# Altium project DDS_PCB.PrjPcb
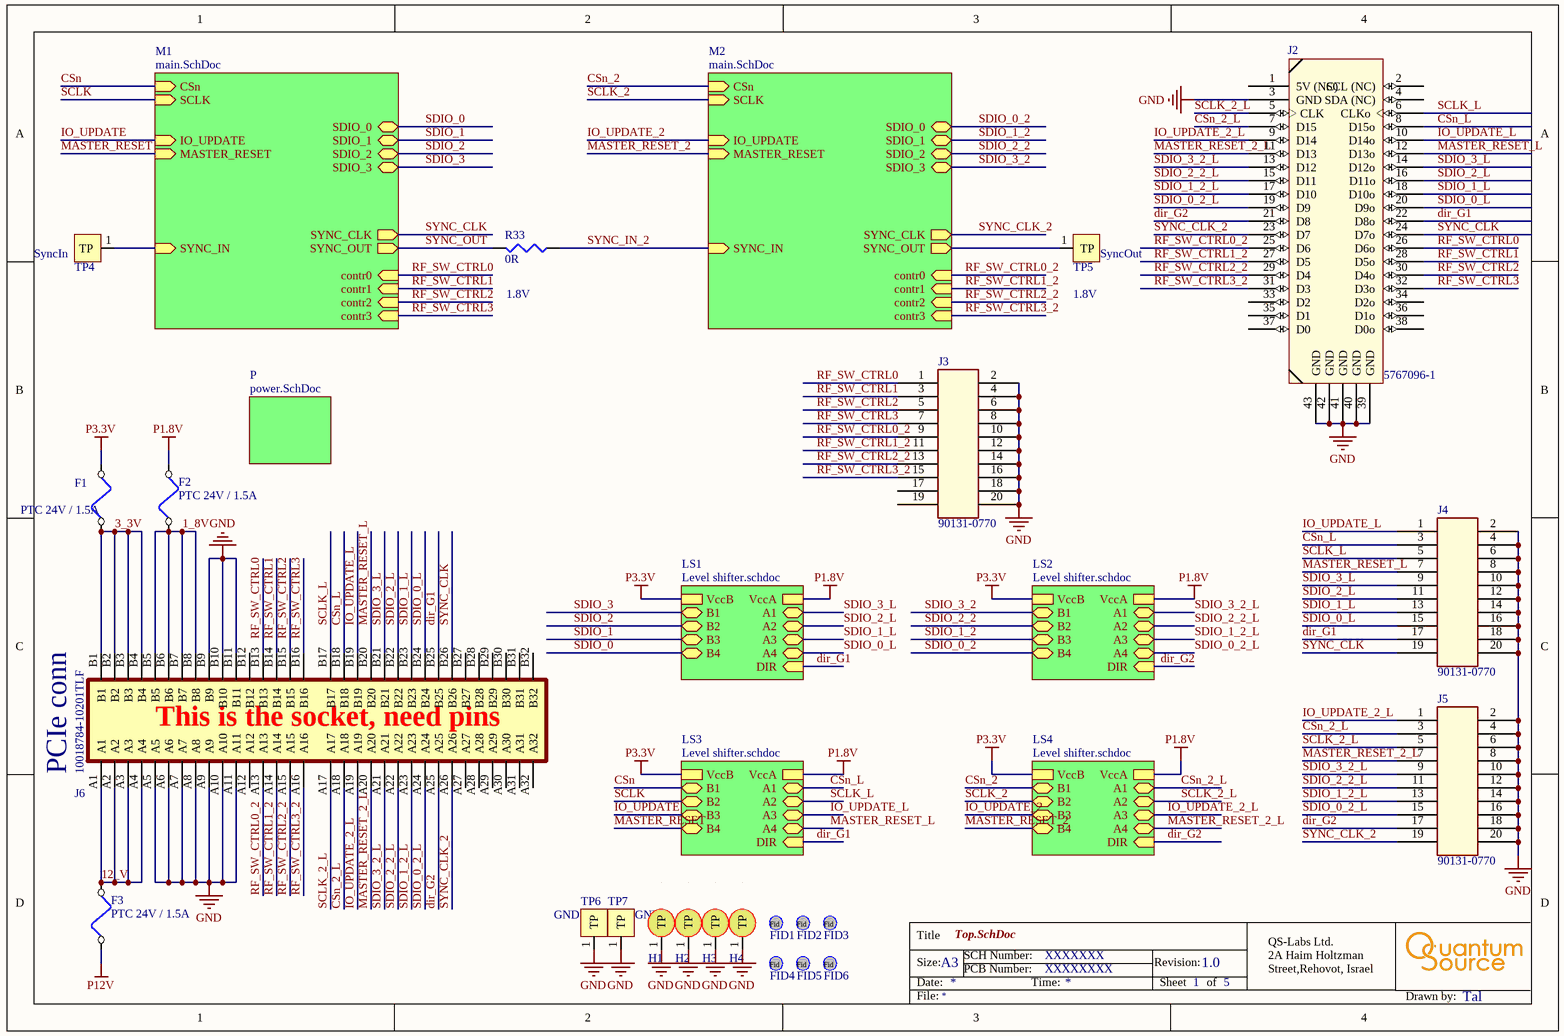
[diagram p0: Top.SchDoc]
Author: Tal; PCB Number: XXXXXXXX; Revision: 1.0; SCH Number: XXXXXXX
5 sheets, 448 parts. Net scope: hierarchical (ports join the sheet entries above them; power ports are global).
Board file: DDS_PCB.PcbDoc
Sheets:
  Top.SchDoc
    M1 = main.SchDoc
      A0 = analog_channel.SchDoc
      A1 = analog_channel.SchDoc
      A2 = analog_channel.SchDoc
      A3 = analog_channel.SchDoc
    P = power.SchDoc
    M2 = main.SchDoc
      A0 = analog_channel.SchDoc
      A1 = analog_channel.SchDoc
      A2 = analog_channel.SchDoc
      A3 = analog_channel.SchDoc
    LS2 = Level Shifter.SchDoc
    LS1 = Level Shifter.SchDoc
    LS3 = Level Shifter.SchDoc
    LS4 = Level Shifter.SchDoc

## Sheet Top.SchDoc
size A4; DocumentNumber: 3; SheetNumber: 1; SheetTotal: 5

### Parts
F1  PTC 24V / 1.5A  [1812_F]
F2  PTC 24V / 1.5A  [1812_F]
F3  PTC 24V / 1.5A  [1812_F]
FID1  Fiducial  [Fiducial]  (value not drawn)
FID2  Fiducial  [Fiducial]  (value not drawn)
FID3  Fiducial  [Fiducial]  (value not drawn)
FID4  Fiducial  [Fiducial]  (value not drawn)
FID5  Fiducial  [Fiducial]  (value not drawn)
FID6  Fiducial  [Fiducial]  (value not drawn)
H1  Hole 3mm  [hole 3mm]  (value not drawn)
H2  Hole 3mm  [hole 3mm]  (value not drawn)
H3  Hole 3mm  [hole 3mm]  (value not drawn)
H4  Hole 3mm  [hole 3mm]  (value not drawn)
J2  5767096-1  [MICTOR-38_PIN]
J3  90131-0770  [HEADER_10x2]
J4  90131-0770  [HEADER_10x2]
J5  90131-0770  [HEADER_10x2]
J6  10018784-10201TLF  [PCIE_8LANE_EDGE]
R33  0R  [R0402]
TP4  SyncIn  [TP_2x1.8]
TP5  SyncOut  [TP_2x1.8]
TP6  GND  [TP_2x1.8]
TP7  GND  [TP_2x1.8]

### Sub-sheets
LS1 = Level shifter.schdoc: A4 (bidir), B3 (bidir), A2 (bidir), B1 (bidir), B4 (bidir), A1 (bidir), B2 (bidir), A3 (bidir), VccA, VccB, DIR (in)
LS2 = Level shifter.schdoc: A4 (bidir), B3 (bidir), A2 (bidir), B1 (bidir), B4 (bidir), A1 (bidir), B2 (bidir), A3 (bidir), VccA, VccB, DIR (in)
LS3 = Level shifter.schdoc: A4 (bidir), B3 (bidir), A2 (bidir), B1 (bidir), B4 (bidir), A1 (bidir), B2 (bidir), A3 (bidir), VccA, VccB, DIR (in)
LS4 = Level shifter.schdoc: A4 (bidir), B3 (bidir), A2 (bidir), B1 (bidir), B4 (bidir), A1 (bidir), B2 (bidir), A3 (bidir), VccA, VccB, DIR (in)
M1 = main.SchDoc: SYNC_CLK (out), SYNC_OUT (out), SDIO_0 (bidir), SDIO_1 (bidir), SDIO_2 (bidir), SDIO_3 (bidir), CSn (in), IO_UPDATE (in), MASTER_RESET (in), SCLK (in), SYNC_IN (in), contr0 (in), contr1 (in), contr2 (in), contr3 (in)
M2 = main.SchDoc: SYNC_CLK (out), SYNC_OUT (out), SDIO_0 (bidir), SDIO_1 (bidir), SDIO_2 (bidir), SDIO_3 (bidir), CSn (in), IO_UPDATE (in), MASTER_RESET (in), SCLK (in), SYNC_IN (in), contr0 (in), contr1 (in), contr2 (in), contr3 (in)
P = power.SchDoc: no entries

### Nets
GND: H1.1(TP) H2.1(TP) H3.1(TP) H4.1(TP) J2.3(GND) J2.39(GND) J2.40(GND) J2.41(GND) J2.42(GND) J2.43(GND) J3.2 J3.4 J3.6 J3.8 J3.10 J3.12 J3.14 J3.16 J3.18 J3.20 J4.2 J4.4 J4.6 J4.8 J4.10 J4.12 J4.14 J4.16 J4.18 J4.20 J5.2 J5.4 J5.6 J5.8 J5.10 J5.12 J5.14 J5.16 J5.18 J5.20 J6.A5 J6.A6 J6.A7 J6.A8 J6.A9 J6.A10 J6.A11 J6.B9 J6.B10 J6.B11 TP6.1(TP) TP7.1(TP)
P1.8V: F2.2 ; sheet LS2/VccA, sheet LS1/VccA, sheet LS3/VccA, sheet LS4/VccA  [project net VccA]
P3.3V: F1.2 ; sheet LS2/VccB, sheet LS1/VccB, sheet LS3/VccB, sheet LS4/VccB  [project net VccB]
P12V: F3.1
1_8V: F2.1 J6.B5 J6.B6 J6.B7 J6.B8
3_3V: F1.1 J6.B1 J6.B2 J6.B3 J6.B4
12_V: F3.2 J6.A1 J6.A2 J6.A3 J6.A4
CSn: sheet M1/CSn, sheet LS3/B1
CSn_2: sheet M2/CSn, sheet LS4/B1
CSn_2_L: J2.7(D15) J5.3 J6.A18 ; sheet LS4/A1
CSn_L: J2.8(D15o) J4.3 J6.B18 ; sheet LS3/A1
dir_G1: J2.22(D8o) J4.17 J6.B25 ; sheet LS1/DIR, sheet LS3/DIR  [project net DIR]
dir_G2: J2.21(D8) J5.17 J6.A25 ; sheet LS2/DIR, sheet LS4/DIR  [project net DIR]
IO_UPDATE: sheet M1/IO_UPDATE, sheet LS3/B3
IO_UPDATE_2: sheet M2/IO_UPDATE, sheet LS4/B3
IO_UPDATE_2_L: J2.9(D14) J5.1 J6.A19 ; sheet LS4/A3
IO_UPDATE_L: J2.10(D14o) J4.1 J6.B19 ; sheet LS3/A3
MASTER_RESET: sheet M1/MASTER_RESET, sheet LS3/B4
MASTER_RESET_2: sheet M2/MASTER_RESET, sheet LS4/B4
MASTER_RESET_2_L: J2.11(D13) J5.7 J6.A20 ; sheet LS4/A4
MASTER_RESET_L: J2.12(D13o) J4.7 J6.B20 ; sheet LS3/A4
RF_SW_CTRL0: J2.26(D6o) J3.1 J6.B13 ; sheet M1/contr0  [project net contr0]
RF_SW_CTRL0_2: J2.25(D6) J3.9 J6.A13 ; sheet M2/contr0  [project net contr0]
RF_SW_CTRL1: J2.28(D5o) J3.3 J6.B14 ; sheet M1/contr1  [project net contr1]
RF_SW_CTRL1_2: J2.27(D5) J3.11 J6.A14 ; sheet M2/contr1  [project net contr1]
RF_SW_CTRL2: J2.30(D4o) J3.5 J6.B15 ; sheet M1/contr2  [project net contr2]
RF_SW_CTRL2_2: J2.29(D4) J3.13 J6.A15 ; sheet M2/contr2  [project net contr2]
RF_SW_CTRL3: J2.32(D3o) J3.7 J6.B16 ; sheet M1/contr3  [project net contr3]
RF_SW_CTRL3_2: J2.31(D3) J3.15 J6.A16 ; sheet M2/contr3  [project net contr3]
SCLK: sheet M1/SCLK, sheet LS3/B2
SCLK_2: sheet M2/SCLK, sheet LS4/B2
SCLK_2_L: J2.5(CLK) J5.5 J6.A17 ; sheet LS4/A2
SCLK_L: J2.6(CLKo) J4.5 J6.B17 ; sheet LS3/A2
SDIO_0: sheet M1/SDIO_0, sheet LS1/B4
SDIO_0_2: sheet M2/SDIO_0, sheet LS2/B4
SDIO_0_2_L: J2.19(D9) J5.15 J6.A24 ; sheet LS2/A4
SDIO_0_L: J2.20(D9o) J4.15 J6.B24 ; sheet LS1/A4
SDIO_1: sheet M1/SDIO_1, sheet LS1/B3
SDIO_1_2: sheet M2/SDIO_1, sheet LS2/B3
SDIO_1_2_L: J2.17(D10) J5.13 J6.A23 ; sheet LS2/A3
SDIO_1_L: J2.18(D10o) J4.13 J6.B23 ; sheet LS1/A3
SDIO_2: sheet M1/SDIO_2, sheet LS1/B2
SDIO_2_2: sheet M2/SDIO_2, sheet LS2/B2
SDIO_2_2_L: J2.15(D11) J5.11 J6.A22 ; sheet LS2/A2
SDIO_2_L: J2.16(D11o) J4.11 J6.B22 ; sheet LS1/A2
SDIO_3: sheet M1/SDIO_3, sheet LS1/B1
SDIO_3_2: sheet M2/SDIO_3, sheet LS2/B1
SDIO_3_2_L: J2.13(D12) J5.9 J6.A21 ; sheet LS2/A1
SDIO_3_L: J2.14(D12o) J4.9 J6.B21 ; sheet LS1/A1
SYNC_CLK: J2.24(D7o) J4.19 J6.B26 ; sheet M1/SYNC_CLK
SYNC_CLK_2: J2.23(D7) J5.19 J6.A26 ; sheet M2/SYNC_CLK
SYNC_IN: TP4.1(TP) ; sheet M1/SYNC_IN
SYNC_IN_2: R33.1 ; sheet M2/SYNC_IN
SYNC_OUT: TP5.1(TP) ; sheet M2/SYNC_OUT
SYNC_OUT: R33.2 ; sheet M1/SYNC_OUT  [a separate net that carries the same name]

Not connected (* = marked no-connect by the designer): J2 1(5V_(NC)) 2(SCL_(NC)) 4(SDA_(NC)) 33(D2) 34(D2o) 35(D1) 36(D1o) 37(D0) 38(D0o); J3 17 19; J6 A12 A27 A28 A29 A30 A31 A32 B12 B27 B28 B29 B30 B31 B32

### Notes on the sheet
- (near R33) 1.8V
- (near TP5) 1.8V
- (near J6) PCIe conn
- (near J6) This is the socket, need pins
- Title
- Size:
- Date:
- A3
- PCB Number:
- SCH Number:
- Time:
- Revision:
- Sheet
- of
- QS-Labs Ltd.
  2A Haim Holtzman Street,Rehovot, Israel
- File:
- Drawn by:
- (in symbol Fiducial) Fid

### Library data of the parts
F1-F3 = 1812L150/24MR: FUSE PTC 24V 1.5A POLYFUSE 1812; Manufacturer: Littelfuse Inc; LANDA P/N: EFS-000011; Package / Case: 1812 (4532 Metric), Concave; RoHS: RoHS Compliant; Manufacturer Part Number: 1812L150/24MR; ComponentLink1URL: http://www.littelfuse.com/data/en/Data_Sheets/Littelfuse_PTC_1812L.pdf; ComponentLink1Description: http://www.littelfuse.com/data/en/Data_Sheets/Littelfuse_PTC_1812L.pdf; Current - Hold (Ih) (Max): 1.5A
FID1-FID6 = Fiducial: Assembly: NA
J2 = 5767096-1: CONN MICTOR 38POS .025 VERT SMD; Manufacturer: TE Connectivity; LANDA P/N: ECN-000060; RoHS: RoHS Compliant; ComponentLink1URL: http://www.te.com/commerce/DocumentDelivery/DDEController?Action=srchrtrv&DocNm=5767096&DocType=Customer+Drawing&DocLang=English; ComponentLink1Description: http://www.te.com/commerce/DocumentDelivery/DDEController?Action=srchrtrv&DocNm=5767096&DocType=Customer+Drawing&DocLang=English; Manufacturer Part Number: 5767096-1
J3-J5 = 90131-0770: CONN HEADER 20 TH; Manufacturer: Molex Connector Corporation; LANDA P/N: ECN-000005; RoHS: RoHS Compliant; Mounting Type: Through Hole; Contact Type: Male Pin; ComponentLink1URL: http://www.molex.com/pdm_docs/sd/901310770_sd.pdf; ComponentLink1Description: http://www.molex.com/pdm_docs/sd/901310770_sd.pdf; Manufacturer Part Number: 90131-0770
J6 = 10018784-10201TLF: 64 Position Female Connector PCI Expressâ„¢ Gold 0.039 _1.00mm_ Black; MF: Amphenol ICC; Price: None; Value: *; MP: 10018784-10201TLF; Package: None; SnapEDA_Link: https://www.snapeda.com/parts/10018784-10201TLF/Amphenol%20FCI/view-part/2598016/?ref=snap; Availability: Unavailable
R33 = RES 100 OHM 1/10W 1% 0402 SMD: RES 0 OHM 1/10W 1% 0402 SMD; Manufacturer Part Number: ERJ-2RKF1000X; Manufacturer: Panasonic Electronic Components; LANDA P/N: ERS-000079; Assembly: N.C; Package / Case: 0402 (1005 Metric); RoHS: RoHS Compliant; ComponentLink1URL: http://industrial.panasonic.com/www-cgi/jvcr13pz.cgi?E+PZ+3+AOA0002+ERJ2RKF1000X+7+WW; ComponentLink1Description: http://industrial.panasonic.com/www-cgi/jvcr13pz.cgi?E+PZ+3+AOA0002+ERJ2RKF1000X+7+WW; Supplier Device Package: 0402
TP4-TP6 = TP mini_2: TP PC MINIATURE SMT; Manufacturer: Keystone Electronics; Manufacturer Part Number: 5015; Assembly: N.A; LANDA P/N: ECN-000032; RoHS: RoHS Compliant
TP7 = TP mini_1: TP PC MINIATURE SMT; Manufacturer: Keystone Electronics; Manufacturer Part Number: 5015; Assembly: N.A; LANDA P/N: ECN-000032; RoHS: RoHS Compliant

## Sheet main.SchDoc
size A4; DocumentNumber: 1; SheetNumber: 2; SheetTotal: 5; SPICEModelCacheQOCYWOGJ: <root> / <DocumentId>QOCYWOGJ</DocumentId> / </root>
Used 2 times, as channels M1, M2. Parts and nets are listed once, with the designators drawn on the sheet.
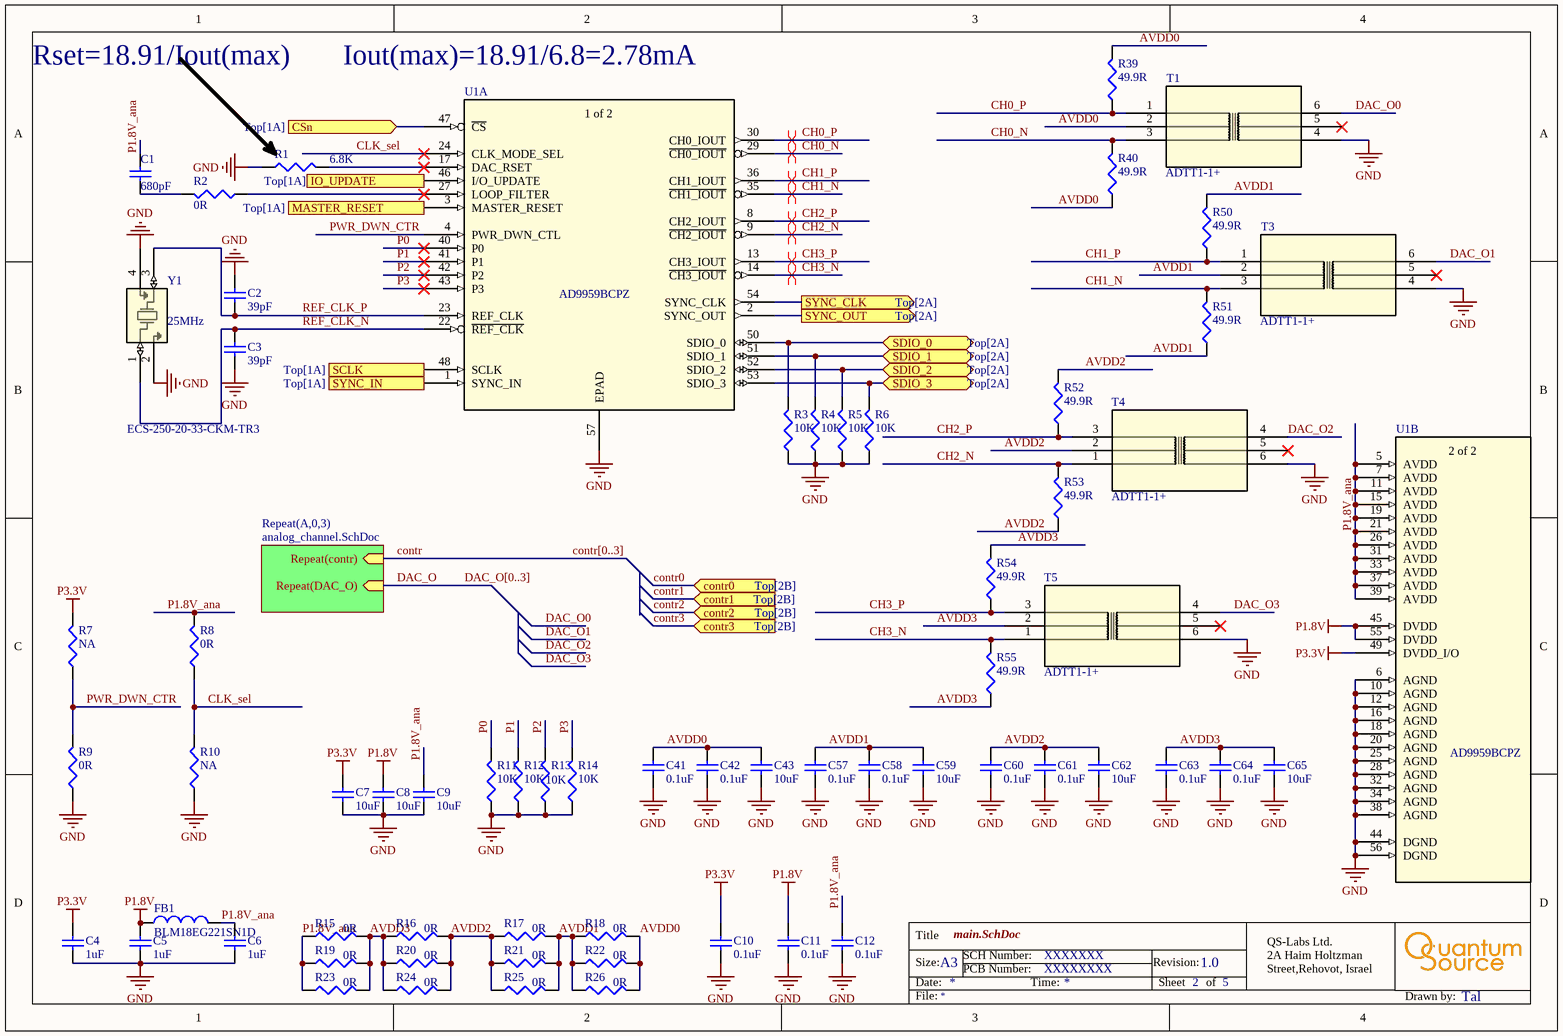
[diagram p1: main.SchDoc]

### Parts
C1  Capacitance: 680pF  [C0402]  (hidden comment: 680pF 50V)
C2  Capacitance: 39pF  [C0402]  (hidden comment: 39pF 50V)
C3  Capacitance: 39pF  [C0402]  (hidden comment: 39pF 50V)
C4  Capacitance: 1uF  [C0402]  (hidden comment: 1uF 25V)
C5  Capacitance: 1uF  [C0402]  (hidden comment: 1uF 25V)
C6  Capacitance: 1uF  [C0402]  (hidden comment: 1uF 25V)
C7  Capacitance: 10uF  [C0402]  (hidden comment: 10uF 10V)
C8  Capacitance: 10uF  [C0402]  (hidden comment: 10uF 10V)
C9  Capacitance: 10uF  [C0402]  (hidden comment: 10uF 10V)
C10  Capacitance: 0.1uF  [C0402]  (hidden comment: 0.1uF 50V)
C11  Capacitance: 0.1uF  [C0402]  (hidden comment: 0.1uF 50V)
C12  Capacitance: 0.1uF  [C0402]  (hidden comment: 0.1uF 50V)
C41  Capacitance: 0.1uF  [C0402]  (hidden comment: 0.1uF 50V)
C42  Capacitance: 0.1uF  [C0402]  (hidden comment: 0.1uF 50V)
C43  Capacitance: 10uF  [C0402]  (hidden comment: 10uF 10V)
C57  Capacitance: 0.1uF  [C0402]  (hidden comment: 0.1uF 50V)
C58  Capacitance: 0.1uF  [C0402]  (hidden comment: 0.1uF 50V)
C59  Capacitance: 10uF  [C0402]  (hidden comment: 10uF 10V)
C60  Capacitance: 0.1uF  [C0402]  (hidden comment: 0.1uF 50V)
C61  Capacitance: 0.1uF  [C0402]  (hidden comment: 0.1uF 50V)
C62  Capacitance: 10uF  [C0402]  (hidden comment: 10uF 10V)
C63  Capacitance: 0.1uF  [C0402]  (hidden comment: 0.1uF 50V)
C64  Capacitance: 0.1uF  [C0402]  (hidden comment: 0.1uF 50V)
C65  Capacitance: 10uF  [C0402]  (hidden comment: 10uF 10V)
FB1  BLM18EG221SN1D  [fb0603]
R1  6.8K  [R0402]
R2  0R  [R0402]
R3  10K  [R0402]
R4  10K  [R0402]
R5  10K  [R0402]
R6  10K  [R0402]
R7  NA  [R0402]
R8  0R  [R0402]
R9  0R  [R0402]
R10  NA  [R0402]
R11  10K  [R0402]
R12  10K  [R0402]
R13  10K  [R0402]
R14  10K  [R0402]
R15  0R  [R0805]
R16  0R  [R0805]
R17  0R  [R0805]
R18  0R  [R0805]
R19  0R  [R0805]
R20  0R  [R0805]
R21  0R  [R0805]
R22  0R  [R0805]
R23  0R  [R0805]
R24  0R  [R0805]
R25  0R  [R0805]
R26  0R  [R0805]
R39  49.9R  [R0402]
R40  49.9R  [R0402]
R50  49.9R  [R0402]
R51  49.9R  [R0402]
R52  49.9R  [R0402]
R53  49.9R  [R0402]
R54  49.9R  [R0402]
R55  49.9R  [R0402]
T1  ADTT1-1+  [CD542_MNC]
T3  ADTT1-1+  [CD542_MNC]
T4  ADTT1-1+  [CD542_MNC]
T5  ADTT1-1+  [CD542_MNC]
U1  AD9959BCPZ  [CP_56_1_ADI]  (parts A,B of 2)
Y1  ECS-250-20-33-CKM-TR3  [SMD4_ECX-32_3p2x2p5_ECS]

### Sub-sheets
Repeat(A,0,3) = analog_channel.SchDoc: Repeat(contr) (in), Repeat(DAC_O) (in)

### Ports
contr0 (in, see Top[2B]), contr1 (in, see Top[2B]), contr2 (in, see Top[2B]), contr3 (in, see Top[2B]), CSn (in, see Top[1A]), IO_UPDATE (in, see Top[1A]), MASTER_RESET (in, see Top[1A]), SCLK (in, see Top[1A]), SDIO_0 (bidir, see Top[2A]), SDIO_1 (bidir, see Top[2A]), SDIO_2 (bidir, see Top[2A]), SDIO_3 (bidir, see Top[2A]), SYNC_CLK (out, see Top[2A]), SYNC_IN (in, see Top[1A]), SYNC_OUT (out, see Top[2A])

### Nets
GND: C2.2 C3.1 C4.1 C5.1 C6.1 C7.1 C8.1 C9.1 C10.1 C11.1 C12.1 C41.1 C42.1 C43.1 C57.1 C58.1 C59.1 C60.1 C61.1 C62.1 C63.1 C64.1 C65.1 R1.1 R3.1 R4.1 R5.1 R6.1 R9.1 R10.1 R11.1 R12.1 R13.1 R14.1 T1.4 T3.4 T4.6 T5.6 U1.6(AGND) U1.10(AGND) U1.12(AGND) U1.16(AGND) U1.18(AGND) U1.20(AGND) U1.25(AGND) U1.28(AGND) U1.32(AGND) U1.34(AGND) U1.38(AGND) U1.44(DGND) U1.56(DGND) U1.57(EPAD) Y1.2 Y1.4
P1.8V: C5.2 C8.2 C11.2 FB1.1 U1.45(DVDD) U1.55(DVDD)
P3.3V: C4.2 C7.2 C10.2 R7.2 U1.49(DVDD_I/O)
AVDD0: C41.2 C42.2 C43.2 R18.2 R22.2 R26.2 R39.2 R40.1 T1.2
AVDD1: C57.2 C58.2 C59.2 R17.2 R18.1 R21.2 R22.1 R25.2 R26.1 R50.2 R51.1 T3.2
AVDD2: C60.2 C61.2 C62.2 R16.2 R17.1 R20.2 R21.1 R24.2 R25.1 R52.2 R53.1 T4.2
AVDD3: C63.2 C64.2 C65.2 R15.2 R16.1 R19.2 R20.1 R23.2 R24.1 R54.2 R55.1 T5.2
CH0_N: R40.2 T1.3 U1.29(~{CH0_IOUT})
CH0_P: R39.1 T1.1 U1.30(CH0_IOUT)
CH1_N: R51.2 T3.3 U1.35(~{CH1_IOUT})
CH1_P: R50.1 T3.1 U1.36(CH1_IOUT)
CH2_N: R53.2 T4.1 U1.9(~{CH2_IOUT})
CH2_P: R52.1 T4.3 U1.8(CH2_IOUT)
CH3_N: R55.2 T5.1 U1.14(~{CH3_IOUT})
CH3_P: R54.1 T5.3 U1.13(CH3_IOUT)
CLK_sel: R8.1 R10.2 U1.24(CLK_MODE_SEL)
contr: sheet Repeat(A,0,3)/Repeat(contr)
contr0: port contr0
contr1: port contr1
contr2: port contr2
contr3: port contr3
CSn: U1.47(~{CS}) ; port CSn
DAC_O: sheet Repeat(A,0,3)/Repeat(DAC_O)
DAC_O0: T1.6
DAC_O1: T3.6
DAC_O2: T4.4
DAC_O3: T5.4
IO_UPDATE: U1.46(I/O_UPDATE) ; port IO_UPDATE
MASTER_RESET: U1.3(MASTER_RESET) ; port MASTER_RESET
P0: R11.2 U1.40(P0)
P1: R12.2 U1.41(P1)
P1.8V_ana: C1.1 C6.2 C9.2 C12.2 FB1.2 R8.2 R15.1 R19.1 R23.1 U1.5(AVDD) U1.7(AVDD) U1.11(AVDD) U1.15(AVDD) U1.19(AVDD) U1.21(AVDD) U1.26(AVDD) U1.31(AVDD) U1.33(AVDD) U1.37(AVDD) U1.39(AVDD)
P2: R13.2 U1.42(P2)
P3: R14.2 U1.43(P3)
PWR_DWN_CTR: R7.1 R9.2 U1.4(PWR_DWN_CTL)
REF_CLK_N: C3.2 U1.22(~{REF_CLK}) Y1.1
REF_CLK_P: C2.1 U1.23(REF_CLK) Y1.3
SCLK: U1.48(SCLK) ; port SCLK
SDIO_0: R3.2 U1.50(SDIO_0) ; port SDIO_0
SDIO_1: R4.2 U1.51(SDIO_1) ; port SDIO_1
SDIO_2: R5.2 U1.52(SDIO_2) ; port SDIO_2
SDIO_3: R6.2 U1.53(SDIO_3) ; port SDIO_3
SYNC_CLK: U1.54(SYNC_CLK) ; port SYNC_CLK
SYNC_IN: U1.1(SYNC_IN) ; port SYNC_IN
SYNC_OUT: U1.2(SYNC_OUT) ; port SYNC_OUT
NetC1_2: C1.2 R2.2
NetR1_2: R1.2 U1.17(DAC_RSET)
NetR2_1: R2.1 U1.27(LOOP_FILTER)

Not connected (* = marked no-connect by the designer): T1 5*; T3 5*; T4 5*; T5 5*

### Channels
M1: designators end in _M1; ports contr0=contr0 contr1=contr1 contr2=contr2 contr3=contr3 CSn=CSn IO_UPDATE=IO_UPDATE MASTER_RESET=MASTER_RESET SCLK=SCLK SDIO_0=SDIO_0 SDIO_1=SDIO_1 SDIO_2=SDIO_2 SDIO_3=SDIO_3 SYNC_CLK=SYNC_CLK SYNC_IN=SYNC_IN SYNC_OUT=SYNC_OUT
M2: designators end in _M2; ports contr0=contr0 contr1=contr1 contr2=contr2 contr3=contr3 CSn=CSn_2 IO_UPDATE=IO_UPDATE_2 MASTER_RESET=MASTER_RESET_2 SCLK=SCLK_2 SDIO_0=SDIO_0_2 SDIO_1=SDIO_1_2 SDIO_2=SDIO_2_2 SDIO_3=SDIO_3_2 SYNC_CLK=SYNC_CLK_2 SYNC_IN=SYNC_IN_2 SYNC_OUT=SYNC_OUT

### Buses and harness runs
bus contr[0..3]
bus DAC_O[0..3]

### Layout directives
differential pair: CH0_N_M1, CH0_P_M1, CH1_N_M1, CH1_P_M1, CH2_N_M1, CH2_P_M1, CH3_N_M1, CH3_P_M1

### Notes on the sheet
- Rset=18.91/Iout(max)
- Iout(max)=18.91/6.8=2.78mA
- (near Y1) 25MHz
- Title
- Size:
- Date:
- A3
- PCB Number:
- SCH Number:
- Time:
- Revision:
- Sheet
- of
- QS-Labs Ltd.
  2A Haim Holtzman Street,Rehovot, Israel
- File:
- Drawn by:
- (in symbol AD9959BCPZ, part A) 1 of 2
- (in symbol AD9959BCPZ, part B) 2 of 2

### Library data of the parts
C1 = CAP CER 6.8pF 50V NP0 0402: CAP CER 680PF 50V NP0 0402; Manufacturer Part Number: C1005C0G1H6R8D; Manufacturer: TDK Corporation; LANDA P/N: ECP-000033; RoHS: RoHS Compliant; Package / Case: 0402 (1005 Metric); ComponentLink1URL: http://www.tdk.com/pdf/general_B11.pdf; ComponentLink1Description: http://www.tdk.com/pdf/general_B11.pdf; Voltage - Rated: 50V
C2 C3 = CAP CER 6.8pF 50V NP0 0402: CAP CER 39PF 50V NP0 0402; Manufacturer Part Number: C1005C0G1H6R8D; Manufacturer: TDK Corporation; LANDA P/N: ECP-000033; RoHS: RoHS Compliant; Package / Case: 0402 (1005 Metric); ComponentLink1URL: http://www.tdk.com/pdf/general_B11.pdf; ComponentLink1Description: http://www.tdk.com/pdf/general_B11.pdf; Voltage - Rated: 50V
C4-C6 = CAP CER 6.8pF 50V NP0 0402: CAP CER 1uF 25V X5R 0402; Manufacturer Part Number: C1005C0G1H6R8D; Manufacturer: TDK Corporation; LANDA P/N: ECP-000033; Voltage - Rated: 50V; RoHS: RoHS Compliant; Package / Case: 0402 (1005 Metric); ComponentLink1URL: http://www.tdk.com/pdf/general_B11.pdf; ComponentLink1Description: http://www.tdk.com/pdf/general_B11.pdf
C7-C9 C43 C59 C62 C65 = CAP CER 6.8pF 50V NP0 0402: CAP CER 10uF 10V X5R 0402; Manufacturer Part Number: C1005C0G1H6R8D; Manufacturer: TDK Corporation; LANDA P/N: ECP-000033; Voltage - Rated: 50V; RoHS: RoHS Compliant; Package / Case: 0402 (1005 Metric); ComponentLink1URL: http://www.tdk.com/pdf/general_B11.pdf; ComponentLink1Description: http://www.tdk.com/pdf/general_B11.pdf
C10-C12 C41 C42 C57 C58 C60 C61 C63 C64 = CAP CER 6.8pF 50V NP0 0402: CAP CER 0.1uF 50V NP0 0402; Manufacturer Part Number: C1005C0G1H6R8D; Manufacturer: TDK Corporation; LANDA P/N: ECP-000033; RoHS: RoHS Compliant; Package / Case: 0402 (1005 Metric); ComponentLink1URL: http://www.tdk.com/pdf/general_B11.pdf; ComponentLink1Description: http://www.tdk.com/pdf/general_B11.pdf; Voltage - Rated: 50V
FB1 = BK1608HS600-T: FERRITE BEAD 220_OHM@100MHz 0603 2A 50mohm_DC; Manufacturer: Taiyo Yuden; LANDA P/N: EIN-000010; RoHS: RoHS Compliant; Package / Case: 0603 (1608 Metric); ComponentLink1URL: http://www.yuden.co.jp/ut/product/category/emisuppression/BK1608HS600-T.pdf; ComponentLink1Description: http://www.yuden.co.jp/ut/product/category/emisuppression/BK1608HS600-T.pdf; Manufacturer Part Number: BLM18EG221SN1D
R1 = RES 3.09K OHM 1/16W 1% 0402: RES 6.8K OHM 1/16W 1% 0402; Manufacturer Part Number: RMCF0402FT3K09; Manufacturer: Stackpole Electronics Inc; Power (Watts): 0.063W, 1/16W; LANDA P/N: ERS-000063; Supplier Device Package: 0402; Package / Case: 0402 (1005 Metric); RoHS: RoHS Compliant; ComponentLink1URL: http://www.seielect.com/Catalog/SEI-RMCF_RMCP.pdf; ComponentLink1Description: http://www.seielect.com/Catalog/SEI-RMCF_RMCP.pdf
R2 R7-R10 = RES 100 OHM 1/10W 1% 0402 SMD: as R33 on sheet Top; Package / Case: 0402 (1005 Metric); RoHS: RoHS Compliant; ComponentLink1URL: http://industrial.panasonic.com/www-cgi/jvcr13pz.cgi?E+PZ+3+AOA0002+ERJ2RKF1000X+7+WW; ComponentLink1Description: http://industrial.panasonic.com/www-cgi/jvcr13pz.cgi?E+PZ+3+AOA0002+ERJ2RKF1000X+7+WW; Supplier Device Package: 0402
R3-R6 R11-R14 = RES 3.09K OHM 1/16W 1% 0402: RES 10K OHM 1/16W 1% 0402; Manufacturer Part Number: RMCF0402FT3K09; Manufacturer: Stackpole Electronics Inc; Power (Watts): 0.063W, 1/16W; LANDA P/N: ERS-000063; Supplier Device Package: 0402; Package / Case: 0402 (1005 Metric); RoHS: RoHS Compliant; ComponentLink1URL: http://www.seielect.com/Catalog/SEI-RMCF_RMCP.pdf; ComponentLink1Description: http://www.seielect.com/Catalog/SEI-RMCF_RMCP.pdf
R15-R26 = RES 200 OHM 1/8W 1% 0805 SMD: RES 0 OHM 1/8W 1% 0805 SMD; Manufacturer Part Number: RMCF0805FT200R; Manufacturer: Stackpole Electronics Inc; Power (Watts): 0.125W, 1/8W; LANDA P/N: ERS-000050; Package / Case: 0805 (2012 Metric); RoHS: RoHS Compliant; Supplier Device Package: 0805; ComponentLink1URL: http://www.seielect.com/Catalog/SEI-RMCF_RMCP.pdf; ComponentLink1Description: http://www.seielect.com/Catalog/SEI-RMCF_RMCP.pdf
R39 R40 R50-R55 = RES 100 OHM 1/10W 1% 0402 SMD: RES 49.9 OHM 1/10W 1% 0402 SMD; Manufacturer Part Number: ERJ-2RKF1000X; Manufacturer: Panasonic Electronic Components; LANDA P/N: ERS-000079; Assembly: N.C; Package / Case: 0402 (1005 Metric); RoHS: RoHS Compliant; ComponentLink1URL: http://industrial.panasonic.com/www-cgi/jvcr13pz.cgi?E+PZ+3+AOA0002+ERJ2RKF1000X+7+WW; ComponentLink1Description: http://industrial.panasonic.com/www-cgi/jvcr13pz.cgi?E+PZ+3+AOA0002+ERJ2RKF1000X+7+WW; Supplier Device Package: 0402
T1 T3-T5 = ADTT1-1+: No Description Available; Mfr_Name: Mini Circuits; Type: DEV; Copyright: Copyright (C) 2023 Ultra Librarian. All rights reserved.; Manufacturer_Part_Number: ADTT1-1+; RefDes: RefDes
U1 = AD9959BCPZ: No Description Available; Mfr_Name: Analog Devices Inc; Copyright: Copyright (C) 2023 Ultra Librarian. All rights reserved.; Manufacturer_Part_Number: AD9959BCPZ; RefDes: RefDes; Type: DEV
Y1 = ECS-250-20-33-CKM-TR3: No Description Available; Mfr_Name: ECS International; Type: DEV; Copyright: Copyright (C) 2023 Ultra Librarian. All rights reserved.; Manufacturer_Part_Number: ECS-250-20-33-CKM-TR3; RefDes: RefDes

## Sheet analog_channel.SchDoc
size A4; DocumentNumber: 5; SheetNumber: 3; SheetTotal: 5
Used 8 times, as channels M1/A0, M1/A1, M1/A2, M1/A3, M2/A0, M2/A1, M2/A2, M2/A3. Parts and nets are listed once, with the designators drawn on the sheet.
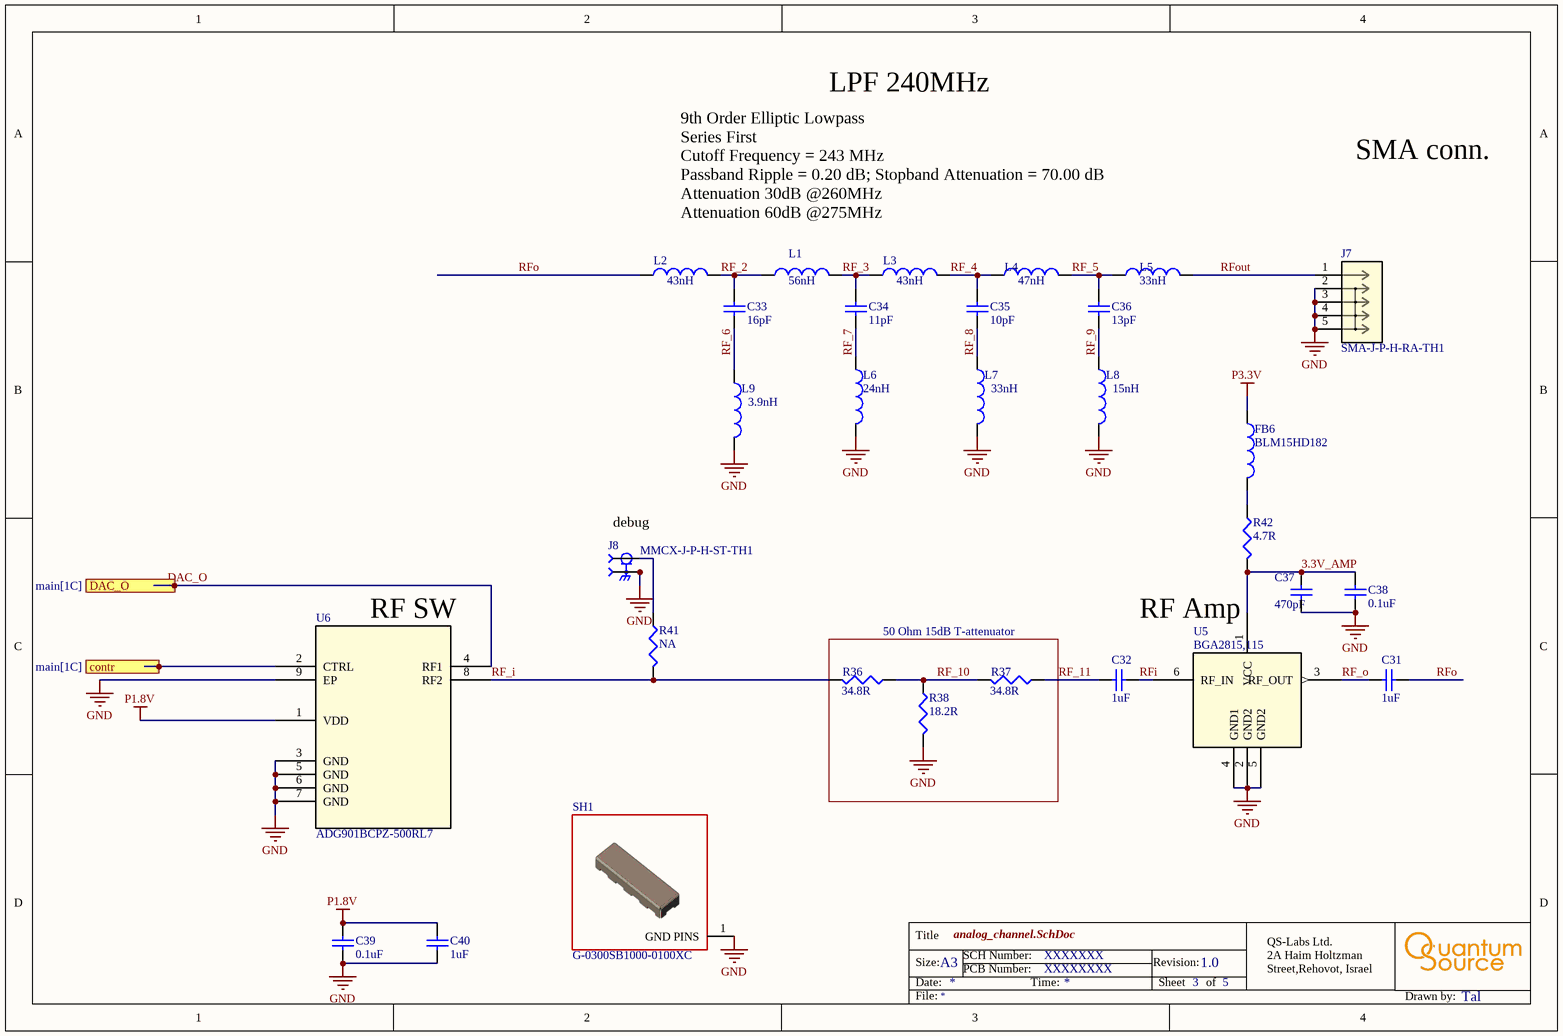
[diagram p2: analog_channel.SchDoc]

### Parts
C31  Capacitance: 1uF  [C0402]  (hidden comment: 1uF 25V)
C32  Capacitance: 1uF  [C0402]  (hidden comment: 1uF 25V)
C33  Capacitance: 16pF  [C0402]  (hidden comment: 16pF 50V)
C34  Capacitance: 11pF  [C0402]  (hidden comment: 11pF 50V)
C35  Capacitance: 10pF  [C0402]  (hidden comment: 10pF 50V)
C36  Capacitance: 13pF  [C0402]  (hidden comment: 13pF 50V)
C37  Capacitance: 470pF  [C0402]  (hidden comment: 470pF 25V)
C38  Capacitance: 0.1uF  [C0402]  (hidden comment: 0.1uF 50V)
C39  Capacitance: 0.1uF  [C0402]  (hidden comment: 0.1uF 50V)
C40  Capacitance: 1uF  [C0402]  (hidden comment: 1uF 25V)
FB6  BLM15HD182  [0402-A]
J7  SMA-J-P-H-RA-TH1  [CONN_SMA-J-P-H-RA-TH1_SAI]
J8  MMCX-J-P-H-ST-TH1  [SAMTEC_MMCX-J-P-H-ST-TH1]
L1  value 56nH  [0402-A]  (hidden comment: Inductor)
L2  value 43nH  [0402-A]  (hidden comment: Inductor)
L3  value 43nH  [0402-A]  (hidden comment: Inductor)
L4  value 47nH  [0402-A]  (hidden comment: Inductor)
L5  value 33nH  [0402-A]  (hidden comment: Inductor)
L6  value 24nH  [0402-A]  (hidden comment: Inductor)
L7  value 33nH  [0402-A]  (hidden comment: Inductor)
L8  value 15nH  [0402-A]  (hidden comment: Inductor)
L9  value 3.9nH  [0402-A]  (hidden comment: Inductor)
R36  34.8R  [r0402]
R37  34.8R  [r0402]
R38  18.2R  [r0402]
R41  NA  [r0402]
R42  4.7R  [r0402]
SH1  G-0300SB1000-0100XC  [RF_Sh]
U5  BGA2815,115  [SOT_2815,115_NXP]
U6  ADG901BCPZ-500RL7  [CP_8_2_ADI]

### Blocks framed on the sheet
50 Ohm 15dB T-attenuator: R36-R38

### Ports
contr (in, see main[1C]), DAC_O (in, see main[1C])

### Nets
GND: C37.1 C38.1 C39.1 C40.1 J7.2 J7.3 J7.4 J7.5 J8.S1 J8.S2 J8.S3 J8.S4 L6.2 L7.2 L8.2 L9.2 R38.2 SH1.1(GND_PINS) U5.2(GND2) U5.4(GND1) U5.5(GND2) U6.3(GND) U6.5(GND) U6.6(GND) U6.7(GND) U6.9(EP)
P1.8V: C39.2 C40.2 U6.1(VDD)
P3.3V: FB6.1
3.3V_AMP: C37.2 C38.2 R42.2 U5.1(VCC)
contr: U6.2(CTRL) ; port contr
DAC_O: U6.4(RF1) ; port DAC_O
RF_2: C33.1 L1.1 L2.2
RF_3: C34.1 L1.2 L3.1
RF_4: C35.1 L3.2 L4.1
RF_5: C36.1 L4.2 L5.1
RF_6: C33.2 L9.1
RF_7: C34.2 L6.1
RF_8: C35.2 L7.1
RF_9: C36.2 L8.1
RF_10: R36.1 R37.2 R38.1
RF_11: C32.1 R37.1
RF_i: R36.2 R41.2 U6.8(RF2)
RF_o: C31.1 U5.3(RF_OUT)
RFi: C32.2 U5.6(RF_IN)
RFo: C31.2 L2.1
RFout: J7.1 L5.2
NetFB6_2: FB6.2 R42.1
NetJ8_1: J8.1 R41.1

### Channels
M1/A0: designators end in _M1_A0; ports contr=contr0 DAC_O=DAC_O
M1/A1: designators end in _M1_A1; ports contr=contr1 DAC_O=DAC_O
M1/A2: designators end in _M1_A2; ports contr=contr2 DAC_O=DAC_O
M1/A3: designators end in _M1_A3; ports contr=contr3 DAC_O=DAC_O
M2/A0: designators end in _M2_A0; ports contr=contr0 DAC_O=DAC_O
M2/A1: designators end in _M2_A1; ports contr=contr1 DAC_O=DAC_O
M2/A2: designators end in _M2_A2; ports contr=contr2 DAC_O=DAC_O
M2/A3: designators end in _M2_A3; ports contr=contr3 DAC_O=DAC_O

### Notes on the sheet
- LPF 240MHz
- SMA conn.
- 9th Order Elliptic Lowpass
  Series First
  Cutoff Frequency = 243 MHz
  Passband Ripple = 0.20 dB; Stopband Attenuation = 70.00 dB
  Attenuation 30dB @260MHz
  Attenuation 60dB @275MHz
- (near J8) debug
- (near U6) RF SW
- RF Amp
- Title
- Size:
- Date:
- A3
- PCB Number:
- SCH Number:
- Time:
- Revision:
- Sheet
- of
- QS-Labs Ltd.
  2A Haim Holtzman Street,Rehovot, Israel
- File:
- Drawn by:

### Library data of the parts
C31 C32 C40 = CAP CER 6.8pF 50V NP0 0402: as C4 on sheet main; RoHS: RoHS Compliant; Package / Case: 0402 (1005 Metric); ComponentLink1URL: http://www.tdk.com/pdf/general_B11.pdf; ComponentLink1Description: http://www.tdk.com/pdf/general_B11.pdf
C33 = CAP CER 20pF 50V 5% NP0 0402: CAP CER 16PF 50V 5% NP0 0402; Manufacturer: TDK Corporation; Manufacturer Part Number: C1005C0G1H200J; LANDA P/N: ECP-000034; Package / Case: 0402 (1005 Metric); RoHS: RoHS Compliant; ComponentLink1URL: http://www.tdk.com/pdf/general_B11.pdf; ComponentLink1Description: http://www.tdk.com/pdf/general_B11.pdf; Voltage - Rated: 50V
C34 = CAP CER 20pF 50V 5% NP0 0402: CAP CER 11PF 50V 5% NP0 0402; Manufacturer: TDK Corporation; Manufacturer Part Number: C1005C0G1H200J; LANDA P/N: ECP-000034; Package / Case: 0402 (1005 Metric); RoHS: RoHS Compliant; ComponentLink1URL: http://www.tdk.com/pdf/general_B11.pdf; ComponentLink1Description: http://www.tdk.com/pdf/general_B11.pdf; Voltage - Rated: 50V
C35 = CAP CER 20pF 50V 5% NP0 0402: CAP CER 10PF 50V 5% NP0 0402; Manufacturer: TDK Corporation; Manufacturer Part Number: C1005C0G1H200J; LANDA P/N: ECP-000034; Package / Case: 0402 (1005 Metric); RoHS: RoHS Compliant; ComponentLink1URL: http://www.tdk.com/pdf/general_B11.pdf; ComponentLink1Description: http://www.tdk.com/pdf/general_B11.pdf; Voltage - Rated: 50V
C36 = CAP CER 20pF 50V 5% NP0 0402: CAP CER 13PF 50V 5% NP0 0402; Manufacturer: TDK Corporation; Manufacturer Part Number: C1005C0G1H200J; LANDA P/N: ECP-000034; Package / Case: 0402 (1005 Metric); RoHS: RoHS Compliant; ComponentLink1URL: http://www.tdk.com/pdf/general_B11.pdf; ComponentLink1Description: http://www.tdk.com/pdf/general_B11.pdf; Voltage - Rated: 50V
C37 = CAP CER 6.8pF 50V NP0 0402: CAP CER 470pF 25V X5R 0402; Manufacturer Part Number: C1005C0G1H6R8D; Manufacturer: TDK Corporation; LANDA P/N: ECP-000033; Voltage - Rated: 50V; RoHS: RoHS Compliant; Package / Case: 0402 (1005 Metric); ComponentLink1URL: http://www.tdk.com/pdf/general_B11.pdf; ComponentLink1Description: http://www.tdk.com/pdf/general_B11.pdf
C38 C39 = CAP CER 6.8pF 50V NP0 0402: as C10 on sheet main; RoHS: RoHS Compliant; Package / Case: 0402 (1005 Metric); ComponentLink1URL: http://www.tdk.com/pdf/general_B11.pdf; ComponentLink1Description: http://www.tdk.com/pdf/general_B11.pdf; Voltage - Rated: 50V
FB6 = BK1608HS600-T: FERRITE BEAD 1.8K OHM 0402 1LN; Manufacturer: Taiyo Yuden; LANDA P/N: EIN-000010; RoHS: RoHS Compliant; Package / Case: 0603 (1608 Metric); ComponentLink1URL: http://www.yuden.co.jp/ut/product/category/emisuppression/BK1608HS600-T.pdf; ComponentLink1Description: http://www.yuden.co.jp/ut/product/category/emisuppression/BK1608HS600-T.pdf; Manufacturer Part Number: BLM15HD182
J7 = SMA-J-P-H-RA-TH1: No Description Available; Mfr_Name: Samtec Inc; Copyright: Copyright (C) 2023 Ultra Librarian. All rights reserved.; Manufacturer_Part_Number: SMA-J-P-H-RA-TH1; RefDes: RefDes; Type: DEV
J8 = MMCX-J-P-H-ST-TH1: MMCX STRAIGHT, THROUGH HOLE JACK- 50 OHM; MF: Samtec; MP: MMCX-J-P-H-ST-TH1; Price: None; Package: None; Value: *; Availability: Unavailable
L1-L9 = Inductor: Code_IEC: 1005; Published: 8-Jun-2000; LatestRevisionDate: 29-May-2009; LatestRevisionNote: IPC-7351 Footprint Added.; PackageReference: 0402-A; Publisher: Altium Limited; PackageDescription: Chip Inductor; Code_JEITA: 0402
R36 R37 = RES 100 OHM 1/10W 1% 0402 SMD: RES 34.8 OHM 1/10W 1% 0402 SMD; Manufacturer Part Number: ERJ-2RKF1000X; Manufacturer: Panasonic Electronic Components; LANDA P/N: ERS-000079; Assembly: N.C; Package / Case: 0402 (1005 Metric); RoHS: RoHS Compliant; ComponentLink1URL: http://industrial.panasonic.com/www-cgi/jvcr13pz.cgi?E+PZ+3+AOA0002+ERJ2RKF1000X+7+WW; ComponentLink1Description: http://industrial.panasonic.com/www-cgi/jvcr13pz.cgi?E+PZ+3+AOA0002+ERJ2RKF1000X+7+WW; Supplier Device Package: 0402
R38 R42 = RES 100 OHM 1/10W 1% 0402 SMD: RES 18.2 OHM 1/10W 1% 0402 SMD; Manufacturer Part Number: ERJ-2RKF1000X; Manufacturer: Panasonic Electronic Components; LANDA P/N: ERS-000079; Assembly: N.C; Package / Case: 0402 (1005 Metric); RoHS: RoHS Compliant; ComponentLink1URL: http://industrial.panasonic.com/www-cgi/jvcr13pz.cgi?E+PZ+3+AOA0002+ERJ2RKF1000X+7+WW; ComponentLink1Description: http://industrial.panasonic.com/www-cgi/jvcr13pz.cgi?E+PZ+3+AOA0002+ERJ2RKF1000X+7+WW; Supplier Device Package: 0402
R41 = RES 100 OHM 1/10W 1% 0402 SMD: as R33 on sheet Top; Package / Case: 0402 (1005 Metric); RoHS: RoHS Compliant; ComponentLink1URL: http://industrial.panasonic.com/www-cgi/jvcr13pz.cgi?E+PZ+3+AOA0002+ERJ2RKF1000X+7+WW; ComponentLink1Description: http://industrial.panasonic.com/www-cgi/jvcr13pz.cgi?E+PZ+3+AOA0002+ERJ2RKF1000X+7+WW; Supplier Device Package: 0402
SH1 = RF_SHIELD_1: RF Shield Cover 0.300" (7.62mm) X 1.000" (25.40mm) Non-Vented Surface Mount; Manufacturer: Orbel Corporation; Manufacturer_Part_Number: G-0300SB1000-0100XC; ComponentLink1Description: Datasheet; ComponentLink1URL: https://www.orbel.com/wp-content/uploads/2022/12/G-0300SB1000-0100XC-COMBINED.pdf
U5 = BGA2815,115: No Description Available; Mfr_Name: NXP; Copyright: Copyright (C) 2023 Ultra Librarian. All rights reserved.; Manufacturer_Part_Number: BGA2815,115; RefDes: RefDes; Type: DEV
U6 = ADG901BCPZ-500RL7: No Description Available; Mfr_Name: Analog Devices Inc; Copyright: Copyright (C) 2023 Ultra Librarian. All rights reserved.; Manufacturer_Part_Number: ADG901BCPZ-500RL7; RefDes: RefDes; Type: DEV

## Sheet power.SchDoc
size A4; DocumentNumber: 2; SheetNumber: 4; SheetTotal: 5
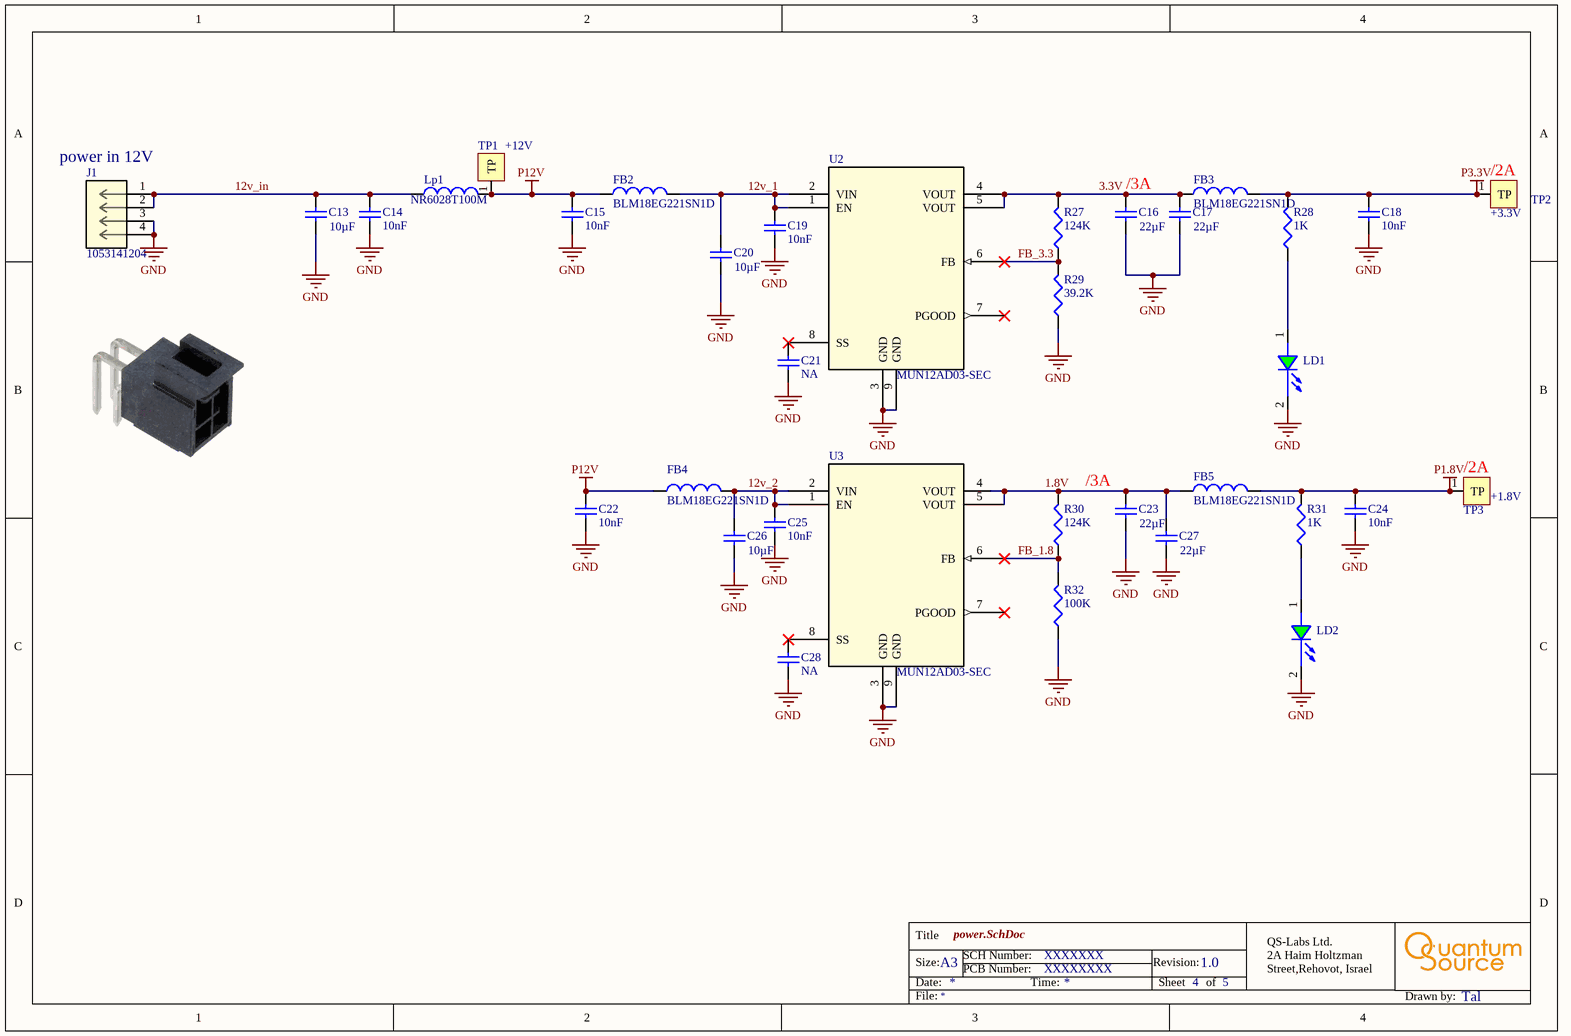
[diagram p3: power.SchDoc]

### Parts
C13  Capacitance: 10µF  [C0603]  (hidden comment: 10uF 25V)
C14  Capacitance: 10nF  [C0402]  (hidden comment: 10nF 25V)
C15  Capacitance: 10nF  [C0402]  (hidden comment: 10nF 25V)
C16  Capacitance: 22µF  [C0603]  (hidden comment: 22uF 16V)
C17  Capacitance: 22µF  [C0603]  (hidden comment: 22uF 16V)
C18  Capacitance: 10nF  [C0402]  (hidden comment: 10nF 25V)
C19  Capacitance: 10nF  [C0402]  (hidden comment: 10nF 25V)
C20  Capacitance: 10µF  [C0603]  (hidden comment: 10uF 25V)
C21  NA  [C0402]
C22  Capacitance: 10nF  [C0402]  (hidden comment: 10nF 25V)
C23  Capacitance: 22µF  [C0603]  (hidden comment: 22uF 16V)
C24  Capacitance: 10nF  [C0402]  (hidden comment: 10nF 25V)
C25  Capacitance: 10nF  [C0402]  (hidden comment: 10nF 25V)
C26  Capacitance: 10µF  [C0603]  (hidden comment: 10uF 25V)
C27  Capacitance: 22µF  [C0603]  (hidden comment: 22uF 16V)
C28  NA  [C0402]
FB2  BLM18EG221SN1D  [fb0603]
FB3  BLM18EG221SN1D  [FB0603]
FB4  BLM18EG221SN1D  [fb0603]
FB5  BLM18EG221SN1D  [fb0603]
J1  1053141204  [CON_1053141204]
LD1  APT1608SGC  [LED_0603_Green]  (value not drawn)
LD2  APT1608SGC  [LED_0603_Green]  (value not drawn)
Lp1  NR6028T100M  [ind6x6_H3]
R27  124K  [R0402]
R28  1K  [R0402]
R29  39.2K  [R0402]
R30  124K  [R0402]
R31  1K  [R0402]
R32  100K  [R0402]
TP1  +12V  [TP_2x1.8]
TP2  +3.3V  [TP_2x1.8]
TP3  +1.8V  [TP_2x1.8]
U2  MUN12AD03-SEC  [SO8_MUN12AD_DEA]
U3  MUN12AD03-SEC  [SO8_MUN12AD_DEA]

### Nets
GND: C13.1 C14.1 C15.1 C16.1 C17.1 C18.1 C19.1 C20.1 C21.1 C22.1 C23.1 C24.1 C25.1 C26.1 C27.1 C28.1 J1.3 J1.4 LD1.2(CATHODE) LD2.2(CATHODE) R29.1 R32.1 U2.3(GND) U2.9(GND) U3.3(GND) U3.9(GND)
P1.8V: C24.2 FB5.2 R31.2 TP3.1(TP)  [project net VccA]
P3.3V: C18.2 FB3.2 R28.2 TP2.1(TP)  [project net VccB]
P12V: C15.2 C22.2 FB2.1 FB4.1 Lp1.2 TP1.1(TP)
1.8V: C23.2 C27.2 FB5.1 R30.2 U3.4(VOUT) U3.5(VOUT)
3.3V: C16.2 C17.2 FB3.1 R27.2 U2.4(VOUT) U2.5(VOUT)
12v_1: C19.2 C20.2 FB2.2 U2.1(EN) U2.2(VIN)
12v_2: C25.2 C26.2 FB4.2 U3.1(EN) U3.2(VIN)
12v_in: C13.2 C14.2 J1.1 J1.2 Lp1.1
FB_1.8: R30.1 R32.2 U3.6(FB)
FB_3.3: R27.1 R29.2 U2.6(FB)
NetC21_2: C21.2 U2.8(SS)
NetC28_2: C28.2 U3.8(SS)
NetLD1_1: LD1.1(ANODE) R28.1
NetLD2_1: LD2.1(ANODE) R31.1

Not connected (* = marked no-connect by the designer): U2 7(PGOOD)*; U3 7(PGOOD)*

### Notes on the sheet
- (near J1) power in 12V
- (near TP2) /2A
- (near C16) /3A
- /3A
- (near TP3) /2A
- Title
- Size:
- Date:
- A3
- PCB Number:
- SCH Number:
- Time:
- Revision:
- Sheet
- of
- QS-Labs Ltd.
  2A Haim Holtzman Street,Rehovot, Israel
- File:
- Drawn by:

### Library data of the parts
C13 C20 C26 = CAP CER 10uF 10V 10% X5R 0603: CAP CER 10UF 25V 10% X5R 0603; Manufacturer Part Number: C1608X5R1A106K; Manufacturer: TDK Corporation; LANDA P/N: ECP-000008; Voltage - Rated: 10V; RoHS: RoHS Compliant; ComponentLink1URL: http://www.tdk.com/pdf/general_B11.pdf; ComponentLink1Description: http://www.tdk.com/pdf/general_B11.pdf; Package / Case: 0603 (1608 Metric)
C14 C15 C18 C19 C22 C24 C25 = CAP CER 12nF 25V 10% X7R 0402: CAP CER 10nF 25V 10% X5R 0402; Manufacturer Part Number: GRM155R71E123KA61D; Manufacturer: Murata Electronics North America; LANDA P/N: ECP-000042; RoHS: RoHS Compliant; Package / Case: 0402 (1005 Metric); ComponentLink1URL: http://search.murata.co.jp/Ceramy/image/img/PDF/ENG/GRM155R71E123KA61.pdf; ComponentLink1Description: http://search.murata.co.jp/Ceramy/image/img/PDF/ENG/GRM155R71E123KA61.pdf; Voltage - Rated: 25V
C16 C17 C23 C27 = CAP CER 10uF 10V 10% X5R 0603: CAP CER 22UF 16V 10% X5R 0603; Manufacturer Part Number: C1608X5R1A106K; Manufacturer: TDK Corporation; LANDA P/N: ECP-000008; Voltage - Rated: 10V; RoHS: RoHS Compliant; ComponentLink1URL: http://www.tdk.com/pdf/general_B11.pdf; ComponentLink1Description: http://www.tdk.com/pdf/general_B11.pdf; Package / Case: 0603 (1608 Metric)
C21 C28 = CAP CER 6.8pF 50V NP0 0402: CAP CER NA 50V NP0 0402; Manufacturer Part Number: C1005C0G1H6R8D; Manufacturer: TDK Corporation; LANDA P/N: ECP-000033; RoHS: RoHS Compliant; Package / Case: 0402 (1005 Metric); ComponentLink1URL: http://www.tdk.com/pdf/general_B11.pdf; ComponentLink1Description: http://www.tdk.com/pdf/general_B11.pdf; Voltage - Rated: 50V; Capacitance: NA
FB2-FB5 = BK1608HS600-T: as FB1 on sheet main; RoHS: RoHS Compliant; Package / Case: 0603 (1608 Metric); ComponentLink1URL: http://www.yuden.co.jp/ut/product/category/emisuppression/BK1608HS600-T.pdf; ComponentLink1Description: http://www.yuden.co.jp/ut/product/category/emisuppression/BK1608HS600-T.pdf; Manufacturer Part Number: BLM18EG221SN1D
J1 = 1053141204: No Description Available; Mfr_Name: Molex Connector Corporation; Copyright: Copyright (C) 2023 Ultra Librarian. All rights reserved.; Manufacturer_Part_Number: 1053141204; RefDes: RefDes; Type: DEV
LD1 LD2 = APT1608SGC: LED 1.6X0.8MM 568NM GRN CLR SMD; Manufacturer: Kingbright Corp; LANDA P/N: EDI-000006; RoHS: RoHS Compliant; Package / Case: 0603 (1608 Metric); ComponentLink1URL: http://www.us.kingbright.com/images/catalog/SPEC/APT1608SGC.pdf; ComponentLink1Description: http://www.us.kingbright.com/images/catalog/SPEC/APT1608SGC.pdf; Manufacturer Part Number: APT1608SGC
Lp1 = NR6028T100M: INDUCTOR 10UH 1.9A 20% SMD; Manufacturer: Taiyo Yuden; Shielding: Shielded; LANDA P/N: EIN-000003; Package / Case: Non Standard; Size / Dimension: 0.236" L x 0.236" W x 0.110" H (6.00mm x 6.00mm x 2.80mm); RoHS: RoHS Compliant; ComponentLink1URL: http://www.yuden.co.jp/ut/product/category/inductor/NR6028T100M.pdf; ComponentLink1Description: http://www.yuden.co.jp/ut/product/category/inductor/NR6028T100M.pdf; Manufacturer Part Number: NR6028T100M
R27 R30 = RES 15.4K OHM 1/10W 1% 0402 SMD: RES 124K OHM 1/10W 1% 0402 SMD; Manufacturer: Panasonic Electronic Components; Manufacturer Part Number: ERJ-2RKF1542X; Power (Watts): 0.1W, 1/10W; LANDA P/N: ERS-000060; Package / Case: 0402 (1005 Metric); Supplier Device Package: 0402; RoHS: RoHS Compliant; ComponentLink1URL: http://industrial.panasonic.com/www-cgi/jvcr13pz.cgi?E+PZ+3+AOA0002+ERJ2RKF1542X+7+WW; ComponentLink1Description: http://industrial.panasonic.com/www-cgi/jvcr13pz.cgi?E+PZ+3+AOA0002+ERJ2RKF1542X+7+WW
R28 R31 = RES 3.09K OHM 1/16W 1% 0402: RES 1K OHM 1/16W 1% 0402; Manufacturer Part Number: RMCF0402FT3K09; Manufacturer: Stackpole Electronics Inc; Power (Watts): 0.063W, 1/16W; LANDA P/N: ERS-000063; Supplier Device Package: 0402; Package / Case: 0402 (1005 Metric); RoHS: RoHS Compliant; ComponentLink1URL: http://www.seielect.com/Catalog/SEI-RMCF_RMCP.pdf; ComponentLink1Description: http://www.seielect.com/Catalog/SEI-RMCF_RMCP.pdf
R29 = RES 15.4K OHM 1/10W 1% 0402 SMD: RES 39.2K OHM 1/10W 1% 0402 SMD; Manufacturer: Panasonic Electronic Components; Manufacturer Part Number: ERJ-2RKF1542X; Power (Watts): 0.1W, 1/10W; LANDA P/N: ERS-000060; Package / Case: 0402 (1005 Metric); Supplier Device Package: 0402; RoHS: RoHS Compliant; ComponentLink1URL: http://industrial.panasonic.com/www-cgi/jvcr13pz.cgi?E+PZ+3+AOA0002+ERJ2RKF1542X+7+WW; ComponentLink1Description: http://industrial.panasonic.com/www-cgi/jvcr13pz.cgi?E+PZ+3+AOA0002+ERJ2RKF1542X+7+WW
R32 = RES 3.09K OHM 1/16W 1% 0402: RES 100K OHM 1/16W 1% 0402; Manufacturer Part Number: RMCF0402FT3K09; Manufacturer: Stackpole Electronics Inc; Power (Watts): 0.063W, 1/16W; LANDA P/N: ERS-000063; Supplier Device Package: 0402; Package / Case: 0402 (1005 Metric); RoHS: RoHS Compliant; ComponentLink1URL: http://www.seielect.com/Catalog/SEI-RMCF_RMCP.pdf; ComponentLink1Description: http://www.seielect.com/Catalog/SEI-RMCF_RMCP.pdf
TP1-TP3 = TP mini_2: as TP4 on sheet Top; RoHS: RoHS Compliant
U2 U3 = MUN12AD03-SEC: No Description Available; Mfr_Name: Delta; Type: DEV; Copyright: Copyright (C) 2023 Ultra Librarian. All rights reserved.; Manufacturer_Part_Number: MUN12AD03-SEC; RefDes: RefDes

## Sheet Level Shifter.SchDoc
size A4; SheetNumber: 5; SheetTotal: 5
Used 4 times, as channels LS2, LS1, LS3, LS4. Parts and nets are listed once, with the designators drawn on the sheet.
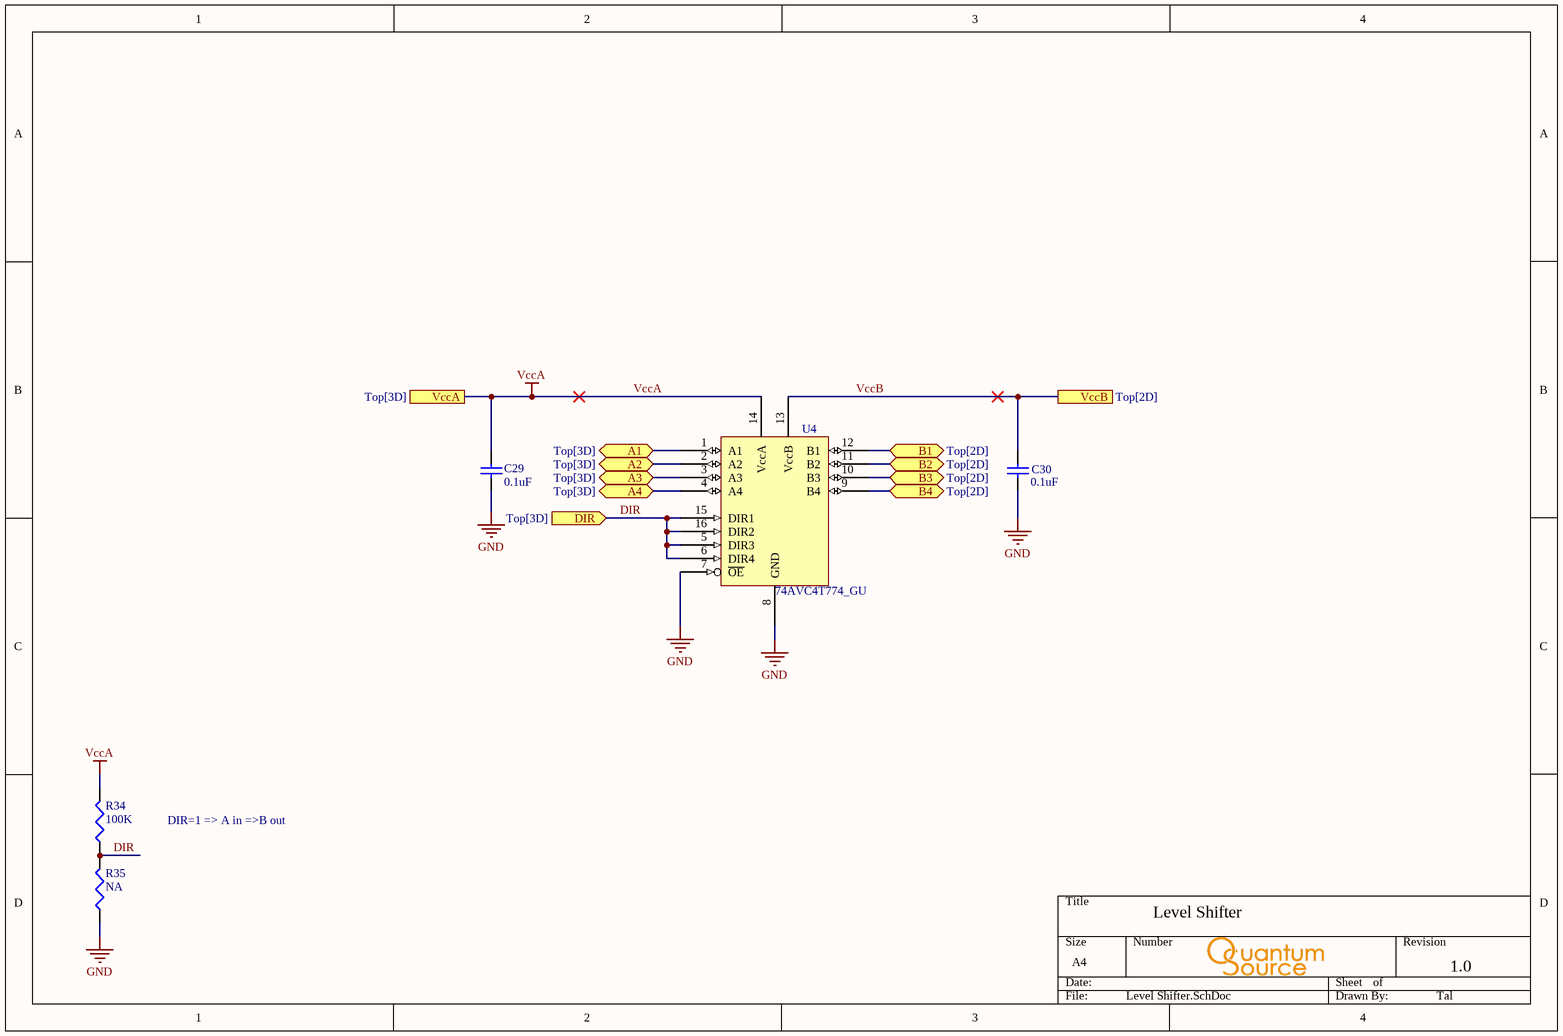
[diagram p4: Level Shifter.SchDoc]

### Parts
C29  Capacitance: 0.1uF  [C0402]  (hidden comment: 0.1uF 50V)
C30  Capacitance: 0.1uF  [C0402]  (hidden comment: 0.1uF 50V)
R34  100K  [R0402]
R35  NA  [R0402]
U4  74AVC4T774_GU  [NXP_74AVC4T245GU,115]

### Ports
A1 (bidir, see Top[3D]), A2 (bidir, see Top[3D]), A3 (bidir, see Top[3D]), A4 (bidir, see Top[3D]), B1 (bidir, see Top[2D]), B2 (bidir, see Top[2D]), B3 (bidir, see Top[2D]), B4 (bidir, see Top[2D]), DIR (in, see Top[3D]), VccA (see Top[3D]), VccB (see Top[2D])

### Nets
GND: C29.1 C30.1 R35.1 U4.7(~{OE}) U4.8(GND)
VccA: C29.2 R34.2 U4.14(VccA) ; port VccA
A1: U4.1(A1) ; port A1
A2: U4.2(A2) ; port A2
A3: U4.3(A3) ; port A3
A4: U4.4(A4) ; port A4
B1: U4.12(B1) ; port B1
B2: U4.11(B2) ; port B2
B3: U4.10(B3) ; port B3
B4: U4.9(B4) ; port B4
DIR: R34.1 R35.2 U4.5(DIR3) U4.6(DIR4) U4.15(DIR1) U4.16(DIR2) ; port DIR
VccB: C30.2 U4.13(VccB) ; port VccB

### Channels
LS2: designators end in _LS2; ports A1=SDIO_3_2_L A2=SDIO_2_2_L A3=SDIO_1_2_L A4=SDIO_0_2_L B1=SDIO_3_2 B2=SDIO_2_2 B3=SDIO_1_2 B4=SDIO_0_2 DIR=DIR VccA=VccA VccB=VccB
LS1: designators end in _LS1; ports A1=SDIO_3_L A2=SDIO_2_L A3=SDIO_1_L A4=SDIO_0_L B1=SDIO_3 B2=SDIO_2 B3=SDIO_1 B4=SDIO_0 DIR=DIR VccA=VccA VccB=VccB
LS3: designators end in _LS3; ports A1=CSn_L A2=SCLK_L A3=IO_UPDATE_L A4=MASTER_RESET_L B1=CSn B2=SCLK B3=IO_UPDATE B4=MASTER_RESET DIR=DIR VccA=VccA VccB=VccB
LS4: designators end in _LS4; ports A1=CSn_2_L A2=SCLK_2_L A3=IO_UPDATE_2_L A4=MASTER_RESET_2_L B1=CSn_2 B2=SCLK_2 B3=IO_UPDATE_2 B4=MASTER_RESET_2 DIR=DIR VccA=VccA VccB=VccB

### Notes on the sheet
- DIR=1 => A in =>B out
- Level Shifter
- 1.0
- Tal

### Library data of the parts
C29 C30 = CAP CER 6.8pF 50V NP0 0402: as C10 on sheet main; RoHS: RoHS Compliant; Package / Case: 0402 (1005 Metric); ComponentLink1URL: http://www.tdk.com/pdf/general_B11.pdf; ComponentLink1Description: http://www.tdk.com/pdf/general_B11.pdf; Voltage - Rated: 50V
R34 = RES 3.09K OHM 1/16W 1% 0402: as R32 on sheet power; Supplier Device Package: 0402; Package / Case: 0402 (1005 Metric); RoHS: RoHS Compliant; ComponentLink1URL: http://www.seielect.com/Catalog/SEI-RMCF_RMCP.pdf; ComponentLink1Description: http://www.seielect.com/Catalog/SEI-RMCF_RMCP.pdf
R35 = RES 3.09K OHM 1/16W 1% 0402: Manufacturer Part Number: RMCF0402FT3K09; Manufacturer: Stackpole Electronics Inc; Power (Watts): 0.063W, 1/16W; LANDA P/N: ERS-000063; Supplier Device Package: 0402; Package / Case: 0402 (1005 Metric); RoHS: RoHS Compliant; ComponentLink1URL: http://www.seielect.com/Catalog/SEI-RMCF_RMCP.pdf; ComponentLink1Description: http://www.seielect.com/Catalog/SEI-RMCF_RMCP.pdf

## Nets that join several sheets
GND: Top (52 pins), M1 (54 pins), M1/A0 (26 pins), M1/A1 (26 pins), M1/A2 (26 pins), M1/A3 (26 pins), power (26 pins), M2 (54 pins), M2/A0 (26 pins), M2/A1 (26 pins), M2/A2 (26 pins), M2/A3 (26 pins), LS2 (5 pins), LS1 (5 pins), LS3 (5 pins), LS4 (5 pins)
P12V: Top (F3.1), power (6 pins)
VccA: Top (F2.2), M1 (6 pins), M1/A0 (C39_M1_A0.2 C40_M1_A0.2 U6_M1_A0.1), M1/A1 (C39_M1_A1.2 C40_M1_A1.2 U6_M1_A1.1), M1/A2 (C39_M1_A2.2 C40_M1_A2.2 U6_M1_A2.1), M1/A3 (C39_M1_A3.2 C40_M1_A3.2 U6_M1_A3.1), power (C24.2 FB5.2 R31.2 TP3.1), M2 (6 pins), M2/A0 (C39_M2_A0.2 C40_M2_A0.2 U6_M2_A0.1), M2/A1 (C39_M2_A1.2 C40_M2_A1.2 U6_M2_A1.1), M2/A2 (C39_M2_A2.2 C40_M2_A2.2 U6_M2_A2.1), M2/A3 (C39_M2_A3.2 C40_M2_A3.2 U6_M2_A3.1), LS2 (C29_LS2.2 R34_LS2.2 U4_LS2.14), LS1 (C29_LS1.2 R34_LS1.2 U4_LS1.14), LS3 (C29_LS3.2 R34_LS3.2 U4_LS3.14), LS4 (C29_LS4.2 R34_LS4.2 U4_LS4.14)
VccB: Top (F1.2), M1 (5 pins), M1/A0 (FB6_M1_A0.1), M1/A1 (FB6_M1_A1.1), M1/A2 (FB6_M1_A2.1), M1/A3 (FB6_M1_A3.1), power (C18.2 FB3.2 R28.2 TP2.1), M2 (5 pins), M2/A0 (FB6_M2_A0.1), M2/A1 (FB6_M2_A1.1), M2/A2 (FB6_M2_A2.1), M2/A3 (FB6_M2_A3.1), LS2 (C30_LS2.2 U4_LS2.13), LS1 (C30_LS1.2 U4_LS1.13), LS3 (C30_LS3.2 U4_LS3.13), LS4 (C30_LS4.2 U4_LS4.13)
contr0: Top (J2.25 J3.9 J6.A13), M2/A0 (U6_M2_A0.2)
contr0: Top (J2.26 J3.1 J6.B13), M1/A0 (U6_M1_A0.2)
contr1: Top (J2.27 J3.11 J6.A14), M2/A1 (U6_M2_A1.2)
contr1: Top (J2.28 J3.3 J6.B14), M1/A1 (U6_M1_A1.2)
contr2: Top (J2.29 J3.13 J6.A15), M2/A2 (U6_M2_A2.2)
contr2: Top (J2.30 J3.5 J6.B15), M1/A2 (U6_M1_A2.2)
contr3: Top (J2.31 J3.15 J6.A16), M2/A3 (U6_M2_A3.2)
contr3: Top (J2.32 J3.7 J6.B16), M1/A3 (U6_M1_A3.2)
CSn: M1 (U1_M1.47), LS3 (U4_LS3.12)
CSn_2: M2 (U1_M2.47), LS4 (U4_LS4.12)
CSn_2_L: Top (J2.7 J5.3 J6.A18), LS4 (U4_LS4.1)
CSn_L: Top (J2.8 J4.3 J6.B18), LS3 (U4_LS3.1)
DAC_O: M1 (T1_M1.6), M1/A0 (U6_M1_A0.4)
DAC_O: M1 (T3_M1.6), M1/A1 (U6_M1_A1.4)
DAC_O: M1 (T4_M1.4), M1/A2 (U6_M1_A2.4)
DAC_O: M1 (T5_M1.4), M1/A3 (U6_M1_A3.4)
DAC_O: M2 (T1_M2.6), M2/A0 (U6_M2_A0.4)
DAC_O: M2 (T3_M2.6), M2/A1 (U6_M2_A1.4)
DAC_O: M2 (T4_M2.4), M2/A2 (U6_M2_A2.4)
DAC_O: M2 (T5_M2.4), M2/A3 (U6_M2_A3.4)
DIR: Top (J2.21 J5.17 J6.A25), LS2 (6 pins), LS4 (6 pins)
DIR: Top (J2.22 J4.17 J6.B25), LS1 (6 pins), LS3 (6 pins)
IO_UPDATE: M1 (U1_M1.46), LS3 (U4_LS3.10)
IO_UPDATE_2: M2 (U1_M2.46), LS4 (U4_LS4.10)
IO_UPDATE_2_L: Top (J2.9 J5.1 J6.A19), LS4 (U4_LS4.3)
IO_UPDATE_L: Top (J2.10 J4.1 J6.B19), LS3 (U4_LS3.3)
MASTER_RESET: M1 (U1_M1.3), LS3 (U4_LS3.9)
MASTER_RESET_2: M2 (U1_M2.3), LS4 (U4_LS4.9)
MASTER_RESET_2_L: Top (J2.11 J5.7 J6.A20), LS4 (U4_LS4.4)
MASTER_RESET_L: Top (J2.12 J4.7 J6.B20), LS3 (U4_LS3.4)
SCLK: M1 (U1_M1.48), LS3 (U4_LS3.11)
SCLK_2: M2 (U1_M2.48), LS4 (U4_LS4.11)
SCLK_2_L: Top (J2.5 J5.5 J6.A17), LS4 (U4_LS4.2)
SCLK_L: Top (J2.6 J4.5 J6.B17), LS3 (U4_LS3.2)
SDIO_0: M1 (R3_M1.2 U1_M1.50), LS1 (U4_LS1.9)
SDIO_0_2: M2 (R3_M2.2 U1_M2.50), LS2 (U4_LS2.9)
SDIO_0_2_L: Top (J2.19 J5.15 J6.A24), LS2 (U4_LS2.4)
SDIO_0_L: Top (J2.20 J4.15 J6.B24), LS1 (U4_LS1.4)
SDIO_1: M1 (R4_M1.2 U1_M1.51), LS1 (U4_LS1.10)
SDIO_1_2: M2 (R4_M2.2 U1_M2.51), LS2 (U4_LS2.10)
SDIO_1_2_L: Top (J2.17 J5.13 J6.A23), LS2 (U4_LS2.3)
SDIO_1_L: Top (J2.18 J4.13 J6.B23), LS1 (U4_LS1.3)
SDIO_2: M1 (R5_M1.2 U1_M1.52), LS1 (U4_LS1.11)
SDIO_2_2: M2 (R5_M2.2 U1_M2.52), LS2 (U4_LS2.11)
SDIO_2_2_L: Top (J2.15 J5.11 J6.A22), LS2 (U4_LS2.2)
SDIO_2_L: Top (J2.16 J4.11 J6.B22), LS1 (U4_LS1.2)
SDIO_3: M1 (R6_M1.2 U1_M1.53), LS1 (U4_LS1.12)
SDIO_3_2: M2 (R6_M2.2 U1_M2.53), LS2 (U4_LS2.12)
SDIO_3_2_L: Top (J2.13 J5.9 J6.A21), LS2 (U4_LS2.1)
SDIO_3_L: Top (J2.14 J4.9 J6.B21), LS1 (U4_LS1.1)
SYNC_CLK: Top (J2.24 J4.19 J6.B26), M1 (U1_M1.54)
SYNC_CLK_2: Top (J2.23 J5.19 J6.A26), M2 (U1_M2.54)
SYNC_IN: Top (TP4.1), M1 (U1_M1.1)
SYNC_IN_2: Top (R33.1), M2 (U1_M2.1)
SYNC_OUT: Top (TP5.1), M2 (U1_M2.2)
SYNC_OUT: Top (R33.2), M1 (U1_M1.2)